# Altium schematic sheet drvinput4.SchDoc
size A4
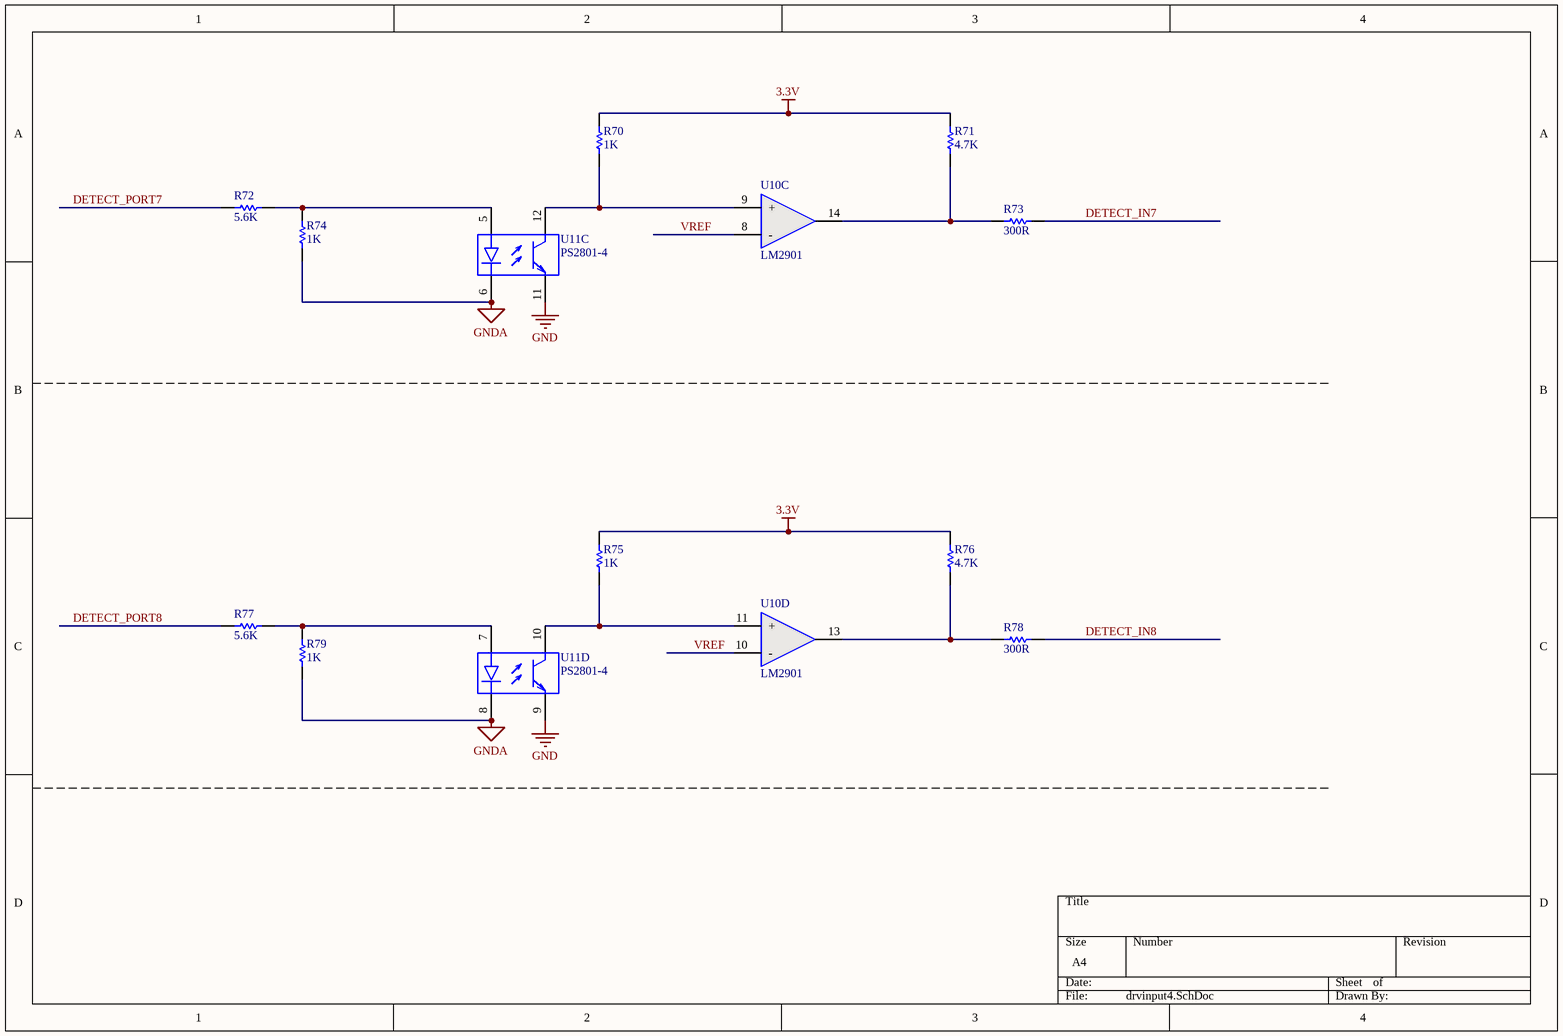
[diagram p0: drvinput4.SchDoc]

## Parts
R70  1K  [RESC2012M]
R71  4.7K  [RESC2012M]
R72  5.6K  [RESC2012M]
R73  300R  [RESC2012M]
R74  1K  [RESC2012M]
R75  1K  [RESC2012M]
R76  4.7K  [RESC2012M]
R77  5.6K  [RESC2012M]
R78  300R  [RESC2012M]
R79  1K  [RESC2012M]
U10  LM2901  [SOIC-14AM]  (parts C,D of 4)
U11  PS2801-4  [SOIC16_N]  (parts C,D of 4)

## Nets
3.3V: R70.1 R71.2 R75.1 R76.2
GND: U11.9(E) U11.11(E)
GNDA: R74.1 R79.1 U11.6(-) U11.8(-)
DETECT_IN7: R73.1
DETECT_IN8: R78.2
DETECT_PORT7: R72.2
DETECT_PORT8: R77.2
VREF: U10.8(-) U10.10(-)
NetR70_2: R70.2 U10.9(+) U11.12(C)
NetR71_1: R71.1 R73.2 U10.14(OUT)
NetR72_1: R72.1 R74.2 U11.5(+)
NetR75_2: R75.2 U10.11(+) U11.10(C)
NetR76_1: R76.1 R78.1 U10.13(OUT)
NetR77_1: R77.1 R79.2 U11.7(+)

## Library data of the parts
R70-R77 R79 = Res1: Resistor; Value: 10K; Published: 8-Jun-2000; LatestRevisionDate: 17-Jul-2002; LatestRevisionNote: Re-released for DXP Platform.; PackageReference: AXIAL-0.3; Publisher: Altium Limited
R78 = Res1: Resistor; Value: 470; Published: 8-Jun-2000; LatestRevisionDate: 17-Jul-2002; LatestRevisionNote: Re-released for DXP Platform.; PackageReference: AXIAL-0.3; Publisher: Altium Limited
U10 = LM2901: 4通道差分比较器芯片
U11 = PS2801-4: The PS2801-1 and PS2801-4 are optically coupled isolators containing a GaAs light emitting diode and an NPN  silicon phototransistor in a plastic SOP for high density applications.; Published: 28-Feb-2003; LatestRevisionDate: 13-Apr-2006; LatestRevisionNote: IPC-7351 Footprint Added.; DatasheetVersion: Jan-2002, Rev. 7; PackageVersion: rev7, Jan-2002; PackageReference: 751-07; Publisher: Altium Limited; PackageDescription: 8-Pin Plastic Small Outline Integrated Circuit 1.27 mm Pitch; Code_JEDEC: MS-012-AA; Code_IPC: SOIC127P600-8; ComponentLink1Description: Manufacturer Link; ComponentLink1URL: http://www.onsemi.com/; ComponentLink2Description: Datasheet; ComponentLink2URL: http://www.onsemi.com/pub/Collateral/LM358-D.PDF